# Altium project SEM_BMS_v1.1.PrjPcb
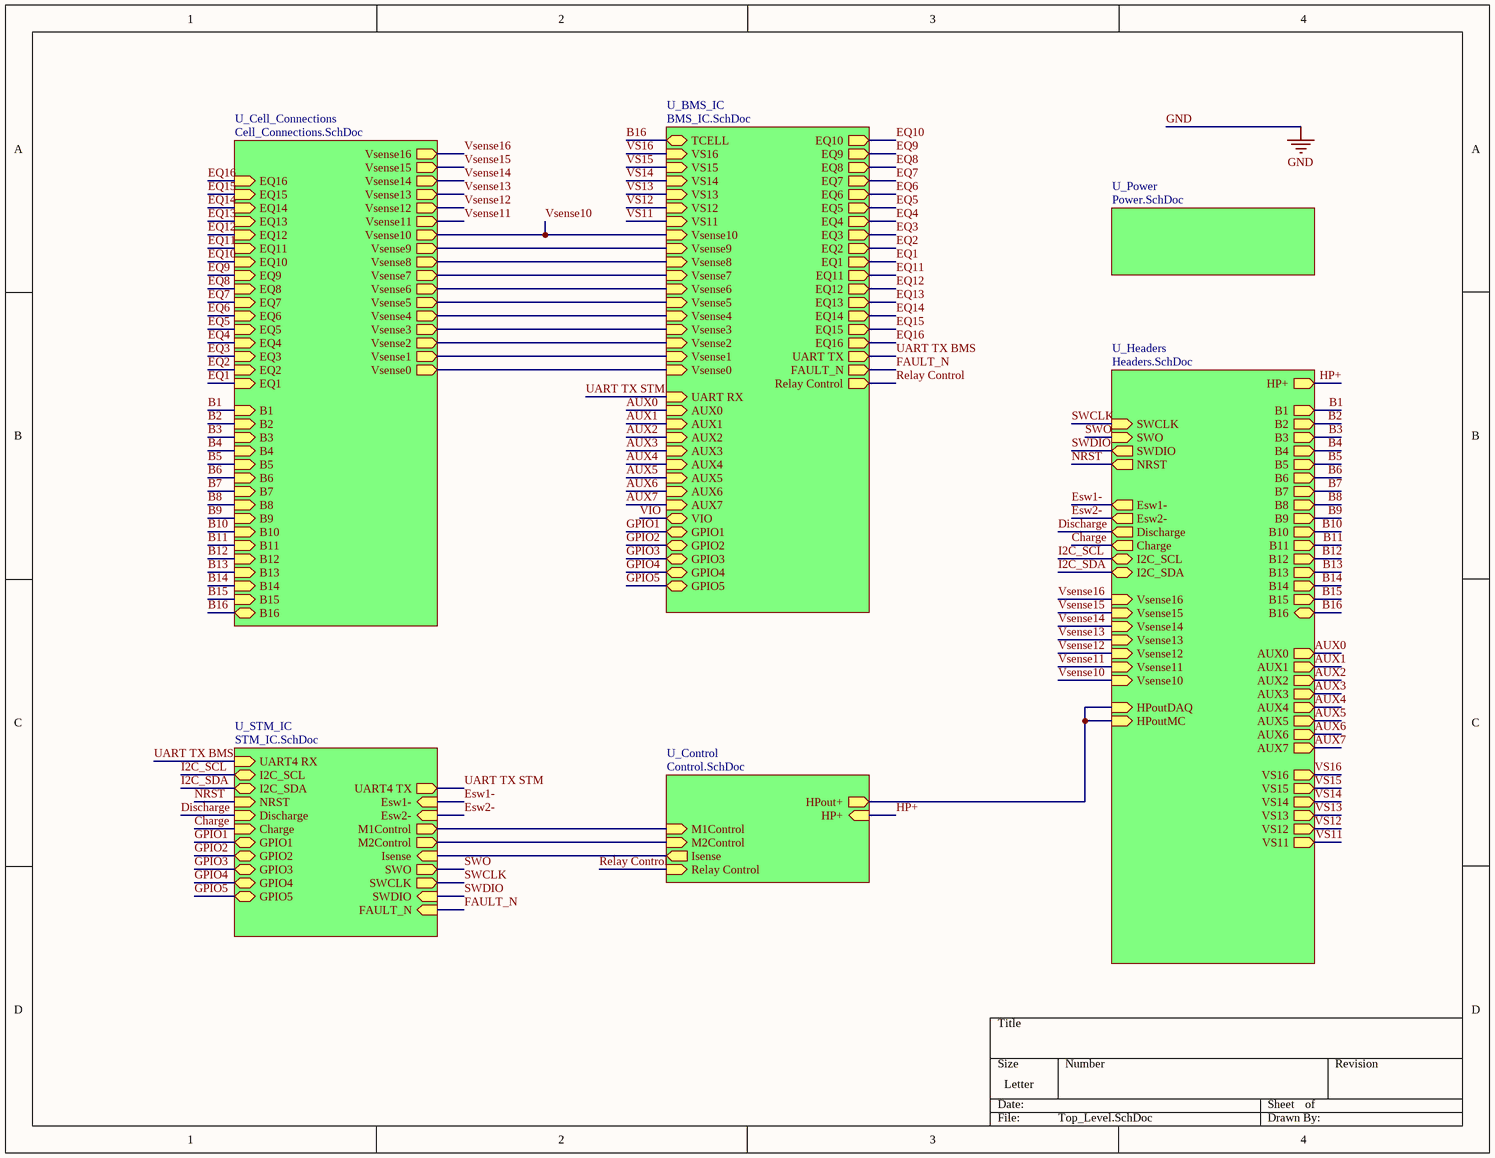
[diagram p0: Top_Level.SchDoc]
7 sheets, 237 parts. Net scope: hierarchical (ports join the sheet entries above them; power ports are global).
Board files: SEM_BMSv1.2.PcbDoc, SEM_BMSv1.3.PcbDoc
Sheets:
  Top_Level.SchDoc
    U_BMS_IC = BMS_IC.SchDoc
    U_Cell_Connections = Cell_Connections.SchDoc
    U_STM_IC = STM_IC.SchDoc
    U_Headers = Headers.SchDoc
    U_Control = Control.SchDoc
    U_Power = Power.SchDoc

## Sheet Top_Level.SchDoc
size Letter

### Sub-sheets
U_BMS_IC = BMS_IC.SchDoc: Vsense10 (in), EQ10 (out), EQ9 (out), EQ8 (out), EQ7 (out), EQ6 (out), EQ5 (out), EQ4 (out), EQ3 (out), EQ2 (out), EQ1 (out), Vsense9 (in), Vsense8 (in), Vsense7 (in), Vsense6 (in), Vsense5 (in), Vsense4 (in), Vsense3 (in), Vsense2 (in), Vsense1 (in), Vsense0 (in), EQ11 (out), EQ12 (out), EQ13 (out), EQ14 (out), EQ15 (out), EQ16 (out), UART TX (out), UART RX (in), FAULT_N (out), AUX0 (in), AUX1 (in), AUX2 (in), AUX3 (in), AUX4 (in), AUX5 (in), AUX6 (in), AUX7 (in), VIO (bidir), GPIO1 (bidir), GPIO2 (bidir), GPIO3 (bidir), GPIO4 (bidir), GPIO5 (bidir), Relay Control (out), TCELL (bidir), VS11 (in), VS12 (in), VS15 (in), VS16 (in), VS13 (in), VS14 (in)
U_Cell_Connections = Cell_Connections.SchDoc: Vsense16 (out), Vsense15 (out), Vsense14 (out), EQ16 (in), EQ15 (in), EQ14 (in), Vsense13 (out), EQ13 (in), EQ12 (in), EQ11 (in), EQ10 (in), Vsense9 (out), Vsense10 (out), Vsense11 (out), Vsense12 (out), EQ9 (in), Vsense8 (out), EQ8 (in), Vsense7 (out), EQ7 (in), Vsense6 (out), EQ6 (in), Vsense5 (out), EQ5 (in), Vsense4 (out), EQ4 (in), Vsense3 (out), EQ3 (in), Vsense2 (out), EQ2 (in), Vsense1 (out), EQ1 (in), Vsense0 (out), B1 (in), B2 (in), B3 (in), B4 (in), B5 (in), B6 (in), B7 (in), B8 (in), B9 (in), B10 (in), B11 (in), B12 (in), B13 (in), B14 (in), B15 (in), B16 (bidir)
U_Control = Control.SchDoc: Isense (out), M2Control (in), M1Control (in), HP+ (in), HPout+ (out), Relay Control (in)
U_Headers = Headers.SchDoc: HP+ (out), B1 (out), B2 (out), B3 (out), B4 (out), B5 (out), B6 (out), B7 (out), B8 (out), B9 (out), B10 (out), B11 (out), B12 (out), B13 (out), B14 (out), B15 (out), B16 (bidir), SWDIO (out), SWCLK (in), SWO (in), NRST (out), AUX0 (out), AUX1 (out), AUX2 (out), AUX3 (out), AUX4 (out), AUX5 (out), AUX6 (out), AUX7 (out), Esw1- (out), Esw2- (out), Discharge (out), Charge (out), I2C_SCL (bidir), I2C_SDA (bidir), VS11 (out), VS16 (out), Vsense11 (in), Vsense16 (in), Vsense10 (in), Vsense14 (in), Vsense13 (in), VS13 (out), Vsense12 (in), VS14 (out), VS12 (out), Vsense15 (in), VS15 (out), HPoutDAQ (in), HPoutMC (in)
U_Power = Power.SchDoc: no entries
U_STM_IC = STM_IC.SchDoc: UART4 TX (out), UART4 RX (in), I2C_SCL (bidir), I2C_SDA (bidir), NRST (in), Esw1- (in), Esw2- (in), SWO (out), SWDIO (in), SWCLK (out), Discharge (in), Charge (in), GPIO1 (bidir), GPIO2 (bidir), GPIO3 (bidir), GPIO4 (bidir), GPIO5 (bidir), Isense (in), M1Control (out), M2Control (out), FAULT_N (in)

### Nets
AUX0: sheet U_BMS_IC/AUX0, sheet U_Headers/AUX0
AUX1: sheet U_BMS_IC/AUX1, sheet U_Headers/AUX1
AUX2: sheet U_BMS_IC/AUX2, sheet U_Headers/AUX2
AUX3: sheet U_BMS_IC/AUX3, sheet U_Headers/AUX3
AUX4: sheet U_BMS_IC/AUX4, sheet U_Headers/AUX4
AUX5: sheet U_BMS_IC/AUX5, sheet U_Headers/AUX5
AUX6: sheet U_BMS_IC/AUX6, sheet U_Headers/AUX6
AUX7: sheet U_BMS_IC/AUX7, sheet U_Headers/AUX7
B1: sheet U_Cell_Connections/B1, sheet U_Headers/B1
B2: sheet U_Cell_Connections/B2, sheet U_Headers/B2
B3: sheet U_Cell_Connections/B3, sheet U_Headers/B3
B4: sheet U_Cell_Connections/B4, sheet U_Headers/B4
B5: sheet U_Cell_Connections/B5, sheet U_Headers/B5
B6: sheet U_Cell_Connections/B6, sheet U_Headers/B6
B7: sheet U_Cell_Connections/B7, sheet U_Headers/B7
B8: sheet U_Cell_Connections/B8, sheet U_Headers/B8
B9: sheet U_Cell_Connections/B9, sheet U_Headers/B9
B10: sheet U_Cell_Connections/B10, sheet U_Headers/B10
B11: sheet U_Cell_Connections/B11, sheet U_Headers/B11
B12: sheet U_Cell_Connections/B12, sheet U_Headers/B12
B13: sheet U_Cell_Connections/B13, sheet U_Headers/B13
B14: sheet U_Cell_Connections/B14, sheet U_Headers/B14
B15: sheet U_Cell_Connections/B15, sheet U_Headers/B15
B16: sheet U_BMS_IC/TCELL, sheet U_Cell_Connections/B16, sheet U_Headers/B16
Charge: sheet U_STM_IC/Charge, sheet U_Headers/Charge
Discharge: sheet U_STM_IC/Discharge, sheet U_Headers/Discharge
EQ1: sheet U_BMS_IC/EQ1, sheet U_Cell_Connections/EQ1
EQ2: sheet U_BMS_IC/EQ2, sheet U_Cell_Connections/EQ2
EQ3: sheet U_BMS_IC/EQ3, sheet U_Cell_Connections/EQ3
EQ4: sheet U_BMS_IC/EQ4, sheet U_Cell_Connections/EQ4
EQ5: sheet U_BMS_IC/EQ5, sheet U_Cell_Connections/EQ5
EQ6: sheet U_BMS_IC/EQ6, sheet U_Cell_Connections/EQ6
EQ7: sheet U_BMS_IC/EQ7, sheet U_Cell_Connections/EQ7
EQ8: sheet U_BMS_IC/EQ8, sheet U_Cell_Connections/EQ8
EQ9: sheet U_BMS_IC/EQ9, sheet U_Cell_Connections/EQ9
EQ10: sheet U_BMS_IC/EQ10, sheet U_Cell_Connections/EQ10
EQ11: sheet U_BMS_IC/EQ11, sheet U_Cell_Connections/EQ11
EQ12: sheet U_BMS_IC/EQ12, sheet U_Cell_Connections/EQ12
EQ13: sheet U_BMS_IC/EQ13, sheet U_Cell_Connections/EQ13
EQ14: sheet U_BMS_IC/EQ14, sheet U_Cell_Connections/EQ14
EQ15: sheet U_BMS_IC/EQ15, sheet U_Cell_Connections/EQ15
EQ16: sheet U_BMS_IC/EQ16, sheet U_Cell_Connections/EQ16
Esw1-: sheet U_STM_IC/Esw1-, sheet U_Headers/Esw1-  [project net Esw1]
Esw2-: sheet U_STM_IC/Esw2-, sheet U_Headers/Esw2-  [project net Esw2]
FAULT_N: sheet U_BMS_IC/FAULT_N, sheet U_STM_IC/FAULT_N
GPIO1: sheet U_BMS_IC/GPIO1, sheet U_STM_IC/GPIO1
GPIO2: sheet U_BMS_IC/GPIO2, sheet U_STM_IC/GPIO2
GPIO3: sheet U_BMS_IC/GPIO3, sheet U_STM_IC/GPIO3
GPIO4: sheet U_BMS_IC/GPIO4, sheet U_STM_IC/GPIO4
GPIO5: sheet U_BMS_IC/GPIO5, sheet U_STM_IC/GPIO5
HP+: sheet U_Headers/HP+, sheet U_Control/HP+
I2C_SCL: sheet U_STM_IC/I2C_SCL, sheet U_Headers/I2C_SCL
I2C_SDA: sheet U_STM_IC/I2C_SDA, sheet U_Headers/I2C_SDA
NRST: sheet U_STM_IC/NRST, sheet U_Headers/NRST
Relay Control: sheet U_BMS_IC/Relay Control, sheet U_Control/Relay Control
SWCLK: sheet U_STM_IC/SWCLK, sheet U_Headers/SWCLK
SWDIO: sheet U_STM_IC/SWDIO, sheet U_Headers/SWDIO
SWO: sheet U_STM_IC/SWO, sheet U_Headers/SWO
UART TX BMS: sheet U_BMS_IC/UART TX, sheet U_STM_IC/UART4 RX
UART TX STM: sheet U_BMS_IC/UART RX, sheet U_STM_IC/UART4 TX
VS11: sheet U_BMS_IC/VS11, sheet U_Headers/VS11
VS12: sheet U_BMS_IC/VS12, sheet U_Headers/VS12
VS13: sheet U_BMS_IC/VS13, sheet U_Headers/VS13
VS14: sheet U_BMS_IC/VS14, sheet U_Headers/VS14
VS15: sheet U_BMS_IC/VS15, sheet U_Headers/VS15
VS16: sheet U_BMS_IC/VS16, sheet U_Headers/VS16
Vsense10: sheet U_BMS_IC/Vsense10, sheet U_Cell_Connections/Vsense10, sheet U_Headers/Vsense10
Vsense11: sheet U_Cell_Connections/Vsense11, sheet U_Headers/Vsense11
Vsense12: sheet U_Cell_Connections/Vsense12, sheet U_Headers/Vsense12
Vsense13: sheet U_Cell_Connections/Vsense13, sheet U_Headers/Vsense13
Vsense14: sheet U_Cell_Connections/Vsense14, sheet U_Headers/Vsense14
Vsense15: sheet U_Cell_Connections/Vsense15, sheet U_Headers/Vsense15
Vsense16: sheet U_Cell_Connections/Vsense16, sheet U_Headers/Vsense16
NetC1_1: sheet U_BMS_IC/Vsense1, sheet U_Cell_Connections/Vsense1
NetC2_1: sheet U_BMS_IC/Vsense2, sheet U_Cell_Connections/Vsense2
NetC3_1: sheet U_BMS_IC/Vsense3, sheet U_Cell_Connections/Vsense3
NetC4_1: sheet U_BMS_IC/Vsense4, sheet U_Cell_Connections/Vsense4
NetC5_1: sheet U_BMS_IC/Vsense5, sheet U_Cell_Connections/Vsense5
NetC6_1: sheet U_BMS_IC/Vsense6, sheet U_Cell_Connections/Vsense6
NetC7_1: sheet U_BMS_IC/Vsense7, sheet U_Cell_Connections/Vsense7
NetC8_1: sheet U_BMS_IC/Vsense8, sheet U_Cell_Connections/Vsense8
NetC9_1: sheet U_BMS_IC/Vsense9, sheet U_Cell_Connections/Vsense9
NetC18_2: sheet U_BMS_IC/Vsense0, sheet U_Cell_Connections/Vsense0
NetP2_1: sheet U_Headers/HPoutDAQ, sheet U_Headers/HPoutMC, sheet U_Control/HPout+
NetU2_20: sheet U_STM_IC/Isense, sheet U_Control/Isense
NetU2_53: sheet U_STM_IC/M1Control, sheet U_Control/M1Control
(unnamed): sheet U_STM_IC/M2Control, sheet U_Control/M2Control

## Sheet BMS_IC.SchDoc
size Letter
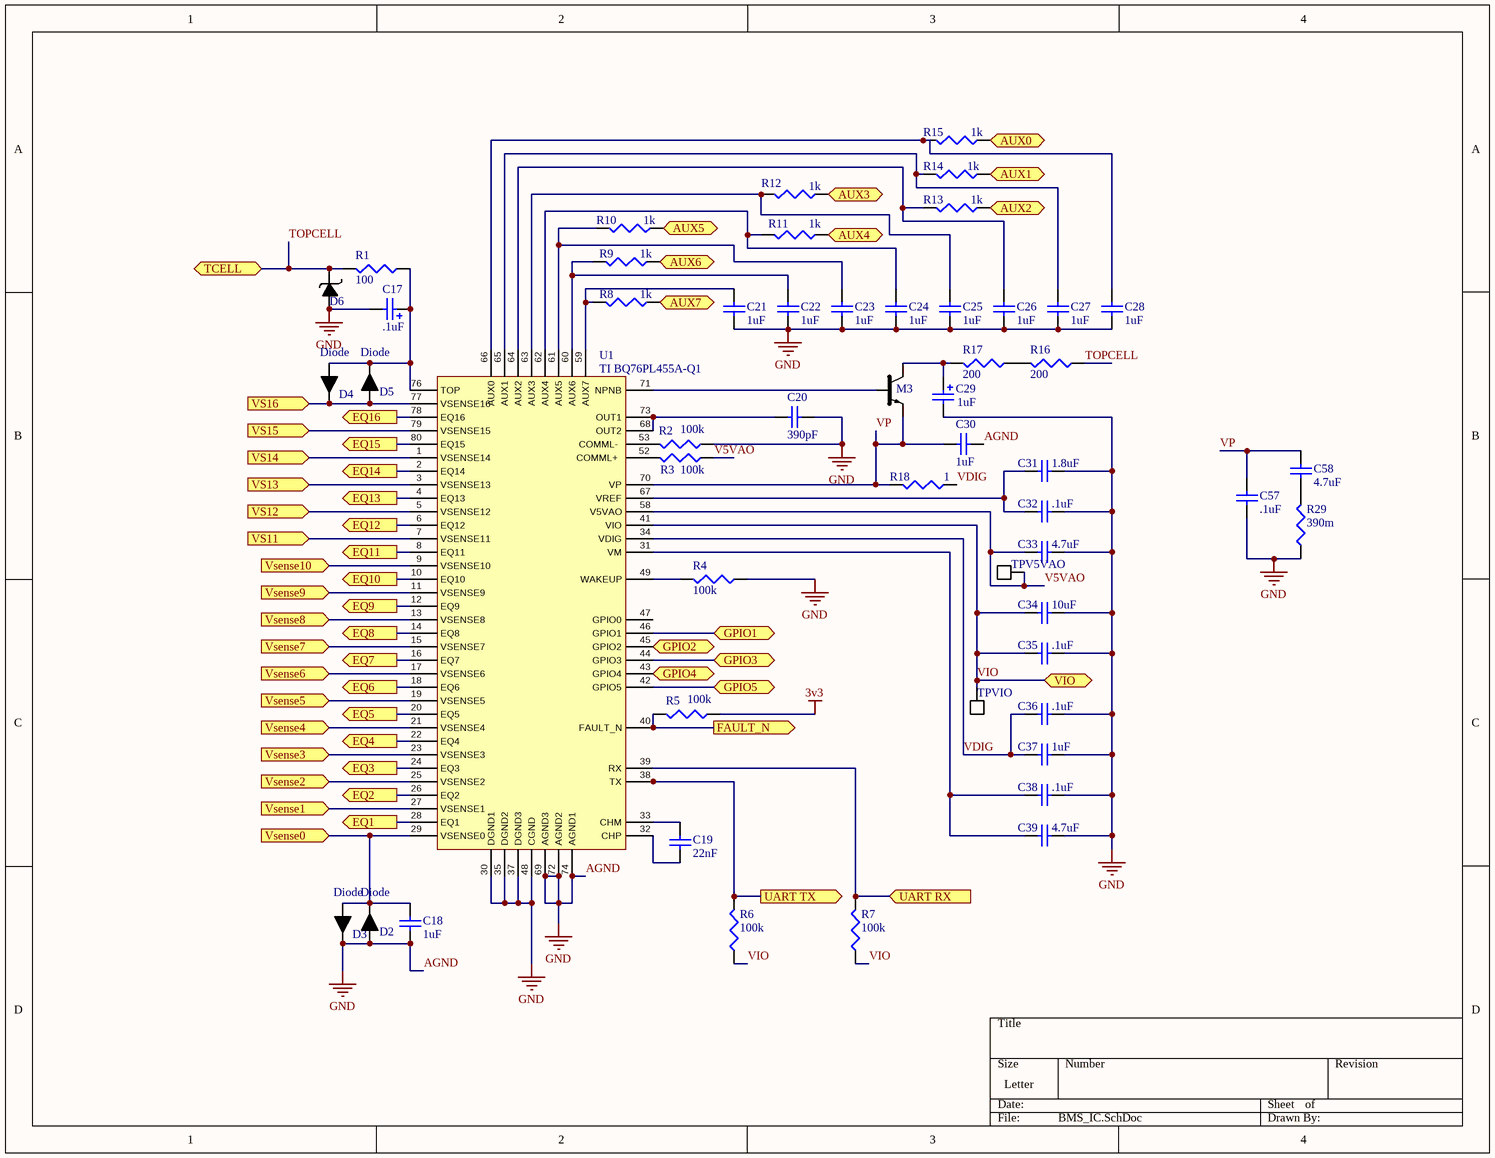
[diagram p1: BMS_IC.SchDoc]

### Parts
C17  value .1uF  [SMD1206 Polarized]  (hidden comment: Cap)
C18  value 1uF  [SMD0603]  (hidden comment: Cap)
C19  value 22nF  [SMD0603]  (hidden comment: Cap)
C20  value 390pF  [SMD0805]  (hidden comment: Cap)
C21  value 1uF  [SMD0603]  (hidden comment: Cap)
C22  value 1uF  [SMD0603]  (hidden comment: Cap)
C23  value 1uF  [SMD0603]  (hidden comment: Cap)
C24  value 1uF  [SMD0603]  (hidden comment: Cap)
C25  value 1uF  [SMD0603]  (hidden comment: Cap)
C26  value 1uF  [SMD0603]  (hidden comment: Cap)
C27  value 1uF  [SMD0603]  (hidden comment: Cap)
C28  value 1uF  [SMD0603]  (hidden comment: Cap)
C29  value 1uF  [SMD1206 Polarized]  (hidden comment: Cap)
C30  value 1uF  [SMD0603]  (hidden comment: Cap)
C31  value 1.8uF  [SMD0603]  (hidden comment: Cap)
C32  value .1uF  [SMD0603]  (hidden comment: Cap)
C33  value 4.7uF  [SMD0603]  (hidden comment: Cap)
C34  value 10uF  [SMD0603]  (hidden comment: Cap)
C35  value .1uF  [SMD0603]  (hidden comment: Cap)
C36  value .1uF  [SMD0603]  (hidden comment: Cap)
C37  value 1uF  [SMD0603]  (hidden comment: Cap)
C38  value .1uF  [SMD0603]  (hidden comment: Cap)
C39  value 4.7uF  [SMD0603]  (hidden comment: Cap)
C57  value .1uF  [SMD0603]  (hidden comment: Cap)
C58  value 4.7uF  [SMD0603]  (hidden comment: Cap)
D2  Diode  [DPAK23]
D3  Diode  [DPAK23]
D4  Diode  [DPAK23]
D5  Diode  [DPAK23]
D6  Zener Diode  [TVS Diode]  (value not drawn)
M3  BJT  [SOT23]  (value not drawn)
R1  value 100  [SMD0603]  (hidden comment: Res)
R2  value 100k  [SMD0603]  (hidden comment: Res)
R3  value 100k  [SMD0603]  (hidden comment: Res)
R4  value 100k  [SMD0603]  (hidden comment: Res)
R5  value 100k  [SMD0603]  (hidden comment: Res)
R6  value 100k  [SMD0603]  (hidden comment: Res)
R7  value 100k  [SMD0603]  (hidden comment: Res)
R8  value 1k  [SMD0603]  (hidden comment: Res)
R9  value 1k  [SMD0603]  (hidden comment: Res)
R10  value 1k  [SMD0603]  (hidden comment: Res)
R11  value 1k  [SMD0603]  (hidden comment: Res)
R12  value 1k  [SMD0603]  (hidden comment: Res)
R13  value 1k  [SMD0603]  (hidden comment: Res)
R14  value 1k  [SMD0603]  (hidden comment: Res)
R15  value 1k  [SMD0603]  (hidden comment: Res)
R16  value 200  [SMD0603]  (hidden comment: Res)
R17  value 200  [SMD0603]  (hidden comment: Res)
R18  value 1  [SMD0603]  (hidden comment: Res)
R29  value 390m  [SMD0603]  (hidden comment: Res)
TPV5VAO  Test Point  [Test Point]  (value not drawn)
TPVIO  Test Point  [Test Point]  (value not drawn)
U1  TI BQ76PL455A-Q1  [TQFP-80]

### Ports
AUX0 (in), AUX1 (in), AUX2 (in), AUX3 (in), AUX4 (in), AUX5 (in), AUX6 (in), AUX7 (in), EQ1 (out), EQ2 (out), EQ3 (out), EQ4 (out), EQ5 (out), EQ6 (out), EQ7 (out), EQ8 (out), EQ9 (out), EQ10 (out), EQ11 (out), EQ12 (out), EQ13 (out), EQ14 (out), EQ15 (out), EQ16 (out), FAULT_N (out), GPIO1 (bidir), GPIO2 (bidir), GPIO3 (bidir), GPIO4 (bidir), GPIO5 (bidir), TCELL (bidir), UART RX (in), UART TX (out), VIO (bidir), VS11 (in), VS12 (in), VS13 (in), VS14 (in), VS15 (in), VS16 (in), Vsense0 (in), Vsense1 (in), Vsense2 (in), Vsense3 (in), Vsense4 (in), Vsense5 (in), Vsense6 (in), Vsense7 (in), Vsense8 (in), Vsense9 (in), Vsense10 (in)

### Nets
3v3: R5.1
AGND: C17.2 C18.1 C20.1 C21.1 C22.1 C23.1 C24.1 C25.1 C26.1 C27.1 C28.1 C29.2 C30.1 C31.1 C32.1 C33.1 C34.1 C35.1 C36.1 C37.1 C38.1 C39.1 C57.1 D2.3(Anode_(+)) D3.2(Cathode_(-)) D6.1 R2.1 R4.1 R29.1 U1.30(DGND1) U1.35(DGND2) U1.37(DGND3) U1.48(CGND) U1.69(AGND3) U1.72(AGND2) U1.74(AGND1)  [also labelled GND]
AUX0: R15.1 ; port AUX0
AUX1: R14.1 ; port AUX1
AUX2: R13.1 ; port AUX2
AUX3: R12.1 ; port AUX3
AUX4: R11.1 ; port AUX4
AUX5: R10.1 ; port AUX5
AUX6: R9.1 ; port AUX6
AUX7: R8.1 ; port AUX7
EQ1: U1.28(EQ1) ; port EQ1
EQ2: U1.26(EQ2) ; port EQ2
EQ3: U1.24(EQ3) ; port EQ3
EQ4: U1.22(EQ4) ; port EQ4
EQ5: U1.20(EQ5) ; port EQ5
EQ6: U1.18(EQ6) ; port EQ6
EQ7: U1.16(EQ7) ; port EQ7
EQ8: U1.14(EQ8) ; port EQ8
EQ9: U1.12(EQ9) ; port EQ9
EQ10: U1.10(EQ10) ; port EQ10
EQ11: U1.8(EQ11) ; port EQ11
EQ12: U1.6(EQ12) ; port EQ12
EQ13: U1.4(EQ13) ; port EQ13
EQ14: U1.2(EQ14) ; port EQ14
EQ15: U1.80(EQ15) ; port EQ15
EQ16: U1.78(EQ16) ; port EQ16
FAULT_N: R5.2 U1.40(FAULT_N) ; port FAULT_N
GPIO1: U1.46(GPIO1) ; port GPIO1
GPIO2: U1.45(GPIO2) ; port GPIO2
GPIO3: U1.44(GPIO3) ; port GPIO3
GPIO4: U1.43(GPIO4) ; port GPIO4
GPIO5: U1.42(GPIO5) ; port GPIO5
TOPCELL: D6.2 R1.2 R16.1 ; port TCELL  [project net B16]
UART TX BMS: R6.2 U1.38(TX) ; port UART TX
UART TX STM: R7.2 U1.39(RX) ; port UART RX
V5VAO: C33.2 R3.1 TPV5VAO.1 U1.58(V5VAO)
VDIG: C36.2 C37.2 R18.1 U1.34(VDIG)
VIO: C34.2 C35.2 R6.1 R7.1 TPVIO.1 U1.41(VIO) ; port VIO
VP: C30.2 C57.2 C58.2 M3.3 R18.2 U1.70(VP)
VS11: U1.7(VSENSE11) ; port VS11
VS12: U1.5(VSENSE12) ; port VS12
VS13: U1.3(VSENSE13) ; port VS13
VS14: U1.1(VSENSE14) ; port VS14
VS15: U1.79(VSENSE15) ; port VS15
VS16: D4.2(Cathode_(-)) D5.3(Anode_(+)) U1.77(VSENSE16) ; port VS16
Vsense10: U1.9(VSENSE10) ; port Vsense10
NetC1_1: U1.27(VSENSE1) ; port Vsense1
NetC2_1: U1.25(VSENSE2) ; port Vsense2
NetC3_1: U1.23(VSENSE3) ; port Vsense3
NetC4_1: U1.21(VSENSE4) ; port Vsense4
NetC5_1: U1.19(VSENSE5) ; port Vsense5
NetC6_1: U1.17(VSENSE6) ; port Vsense6
NetC7_1: U1.15(VSENSE7) ; port Vsense7
NetC8_1: U1.13(VSENSE8) ; port Vsense8
NetC9_1: U1.11(VSENSE9) ; port Vsense9
NetC17_1: C17.1 D4.3(Anode_(+)) D5.2(Cathode_(-)) R1.1 U1.76(TOP)
NetC18_2: C18.2 D2.2(Cathode_(-)) D3.3(Anode_(+)) U1.29(VSENSE0) ; port Vsense0
NetC19_1: C19.1 U1.32(CHP)
NetC19_2: C19.2 U1.33(CHM)
NetC20_2: C20.2 U1.68(OUT2) U1.73(OUT1)
NetC21_2: C21.2 R8.2 U1.59(AUX7)
NetC22_2: C22.2 R9.2 U1.60(AUX6)
NetC23_2: C23.2 R10.2 U1.61(AUX5)
NetC24_2: C24.2 R11.2 U1.62(AUX4)
NetC25_2: C25.2 R12.2 U1.63(AUX3)
NetC26_2: C26.2 R13.2 U1.64(AUX2)
NetC27_2: C27.2 R14.2 U1.65(AUX1)
NetC28_2: C28.2 R15.2 U1.66(AUX0)
NetC29_1: C29.1 M3.1 R17.2
NetC31_2: C31.2 C32.2 U1.67(VREF)
NetC38_2: C38.2 C39.2 U1.31(VM)
NetC58_1: C58.1 R29.2
NetM3_2: M3.2 U1.71(NPNB)
NetR2_2: R2.2 U1.53(COMML-)
NetR3_2: R3.2 U1.52(COMML+)
NetR4_2: R4.2 U1.49(WAKEUP)
NetR16_2: R16.2 R17.1

Not connected (* = marked no-connect by the designer): U1 47(GPIO0)

### Library data of the parts
C17 C29 = Capacitor Polarized: Polarized Capacitor (Surface Mount)
C18-C28 C30-C39 C57 C58 = Capacitor Ceramic: Ceramic Chip Capacitor
R1-R18 R29 = Resistor
TPV5VAO TPVIO = Test Point: Supplier 1: Digi-Key; Supplier Part Number 1: 5019KCT-ND

## Sheet Cell_Connections.SchDoc
size Letter
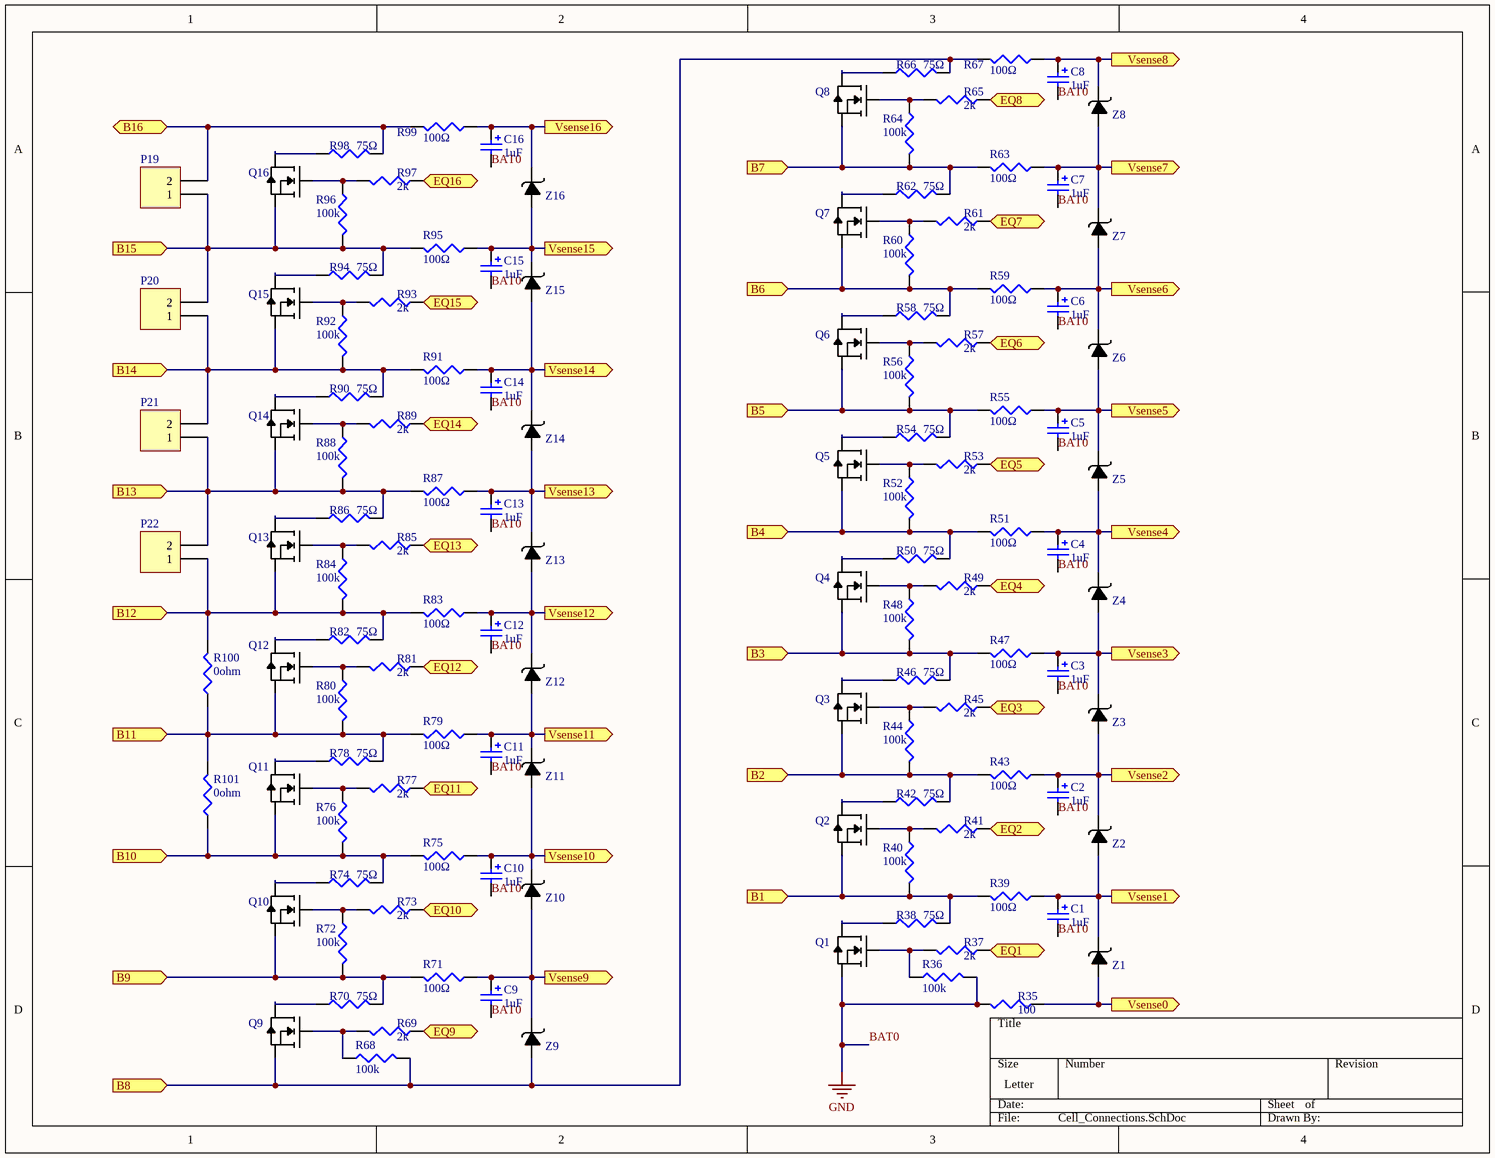
[diagram p2: Cell_Connections.SchDoc]

### Parts
C1  value 1uF  [SMD1206 Polarized]  (hidden comment: Cap)
C2  value 1uF  [SMD1206 Polarized]  (hidden comment: Cap)
C3  value 1uF  [SMD1206 Polarized]  (hidden comment: Cap)
C4  value 1uF  [SMD1206 Polarized]  (hidden comment: Cap)
C5  value 1uF  [SMD1206 Polarized]  (hidden comment: Cap)
C6  value 1uF  [SMD1206 Polarized]  (hidden comment: Cap)
C7  value 1uF  [SMD1206 Polarized]  (hidden comment: Cap)
C8  value 1uF  [SMD1206 Polarized]  (hidden comment: Cap)
C9  value 1uF  [SMD1206 Polarized]  (hidden comment: Cap)
C10  value 1uF  [SMD1206 Polarized]  (hidden comment: Cap)
C11  value 1uF  [SMD1206 Polarized]  (hidden comment: Cap)
C12  value 1uF  [SMD1206 Polarized]  (hidden comment: Cap)
C13  value 1uF  [SMD1206 Polarized]  (hidden comment: Cap)
C14  value 1uF  [SMD1206 Polarized]  (hidden comment: Cap)
C15  value 1uF  [SMD1206 Polarized]  (hidden comment: Cap)
C16  value 1uF  [SMD1206 Polarized]  (hidden comment: Cap)
P19  Header  [Header 2x1]  (value not drawn)
P20  Header  [Header 2x1]  (value not drawn)
P21  Header  [Header 2x1]  (value not drawn)
P22  Header  [Header 2x1]  (value not drawn)
Q1  Transistor  [Transistor 3-Lead]  (value not drawn)
Q2  Transistor  [Transistor 3-Lead]  (value not drawn)
Q3  Transistor  [Transistor 3-Lead]  (value not drawn)
Q4  Transistor  [Transistor 3-Lead]  (value not drawn)
Q5  Transistor  [Transistor 3-Lead]  (value not drawn)
Q6  Transistor  [Transistor 3-Lead]  (value not drawn)
Q7  Transistor  [Transistor 3-Lead]  (value not drawn)
Q8  Transistor  [Transistor 3-Lead]  (value not drawn)
Q9  Transistor  [Transistor 3-Lead]  (value not drawn)
Q10  Transistor  [Transistor 3-Lead]  (value not drawn)
Q11  Transistor  [Transistor 3-Lead]  (value not drawn)
Q12  Transistor  [Transistor 3-Lead]  (value not drawn)
Q13  Transistor  [Transistor 3-Lead]  (value not drawn)
Q14  Transistor  [Transistor 3-Lead]  (value not drawn)
Q15  Transistor  [Transistor 3-Lead]  (value not drawn)
Q16  Transistor  [Transistor 3-Lead]  (value not drawn)
R35  value 100  [SMD0603]  (hidden comment: Res)
R36  value 100k  [SMD0603]  (hidden comment: Res)
R37  value 2k  [SMD0603]  (hidden comment: Res)
R38  value 75Ω  [SMD0603]  (hidden comment: Res)
R39  value 100Ω  [SMD0603]  (hidden comment: Res)
R40  value 100k  [SMD0603]  (hidden comment: Res)
R41  value 2k  [SMD0603]  (hidden comment: Res)
R42  value 75Ω  [SMD0603]  (hidden comment: Res)
R43  value 100Ω  [SMD0603]  (hidden comment: Res)
R44  value 100k  [SMD0603]  (hidden comment: Res)
R45  value 2k  [SMD0603]  (hidden comment: Res)
R46  value 75Ω  [SMD0603]  (hidden comment: Res)
R47  value 100Ω  [SMD0603]  (hidden comment: Res)
R48  value 100k  [SMD0603]  (hidden comment: Res)
R49  value 2k  [SMD0603]  (hidden comment: Res)
R50  value 75Ω  [SMD0603]  (hidden comment: Res)
R51  value 100Ω  [SMD0603]  (hidden comment: Res)
R52  value 100k  [SMD0603]  (hidden comment: Res)
R53  value 2k  [SMD0603]  (hidden comment: Res)
R54  value 75Ω  [SMD0603]  (hidden comment: Res)
R55  value 100Ω  [SMD0603]  (hidden comment: Res)
R56  value 100k  [SMD0603]  (hidden comment: Res)
R57  value 2k  [SMD0603]  (hidden comment: Res)
R58  value 75Ω  [SMD0603]  (hidden comment: Res)
R59  value 100Ω  [SMD0603]  (hidden comment: Res)
R60  value 100k  [SMD0603]  (hidden comment: Res)
R61  value 2k  [SMD0603]  (hidden comment: Res)
R62  value 75Ω  [SMD0603]  (hidden comment: Res)
R63  value 100Ω  [SMD0603]  (hidden comment: Res)
R64  value 100k  [SMD0603]  (hidden comment: Res)
R65  value 2k  [SMD0603]  (hidden comment: Res)
R66  value 75Ω  [SMD0603]  (hidden comment: Res)
R67  value 100Ω  [SMD0603]  (hidden comment: Res)
R68  value 100k  [SMD0603]  (hidden comment: Res)
R69  value 2k  [SMD0603]  (hidden comment: Res)
R70  value 75Ω  [SMD0603]  (hidden comment: Res)
R71  value 100Ω  [SMD0603]  (hidden comment: Res)
R72  value 100k  [SMD0603]  (hidden comment: Res)
R73  value 2k  [SMD0603]  (hidden comment: Res)
R74  value 75Ω  [SMD0603]  (hidden comment: Res)
R75  value 100Ω  [SMD0603]  (hidden comment: Res)
R76  value 100k  [SMD0603]  (hidden comment: Res)
R77  value 2k  [SMD0603]  (hidden comment: Res)
R78  value 75Ω  [SMD0603]  (hidden comment: Res)
R79  value 100Ω  [SMD0603]  (hidden comment: Res)
R80  value 100k  [SMD0603]  (hidden comment: Res)
R81  value 2k  [SMD0603]  (hidden comment: Res)
R82  value 75Ω  [SMD0603]  (hidden comment: Res)
R83  value 100Ω  [SMD0603]  (hidden comment: Res)
R84  value 100k  [SMD0603]  (hidden comment: Res)
R85  value 2k  [SMD0603]  (hidden comment: Res)
R86  value 75Ω  [SMD0603]  (hidden comment: Res)
R87  value 100Ω  [SMD0603]  (hidden comment: Res)
R88  value 100k  [SMD0603]  (hidden comment: Res)
R89  value 2k  [SMD0603]  (hidden comment: Res)
R90  value 75Ω  [SMD0603]  (hidden comment: Res)
R91  value 100Ω  [SMD0603]  (hidden comment: Res)
R92  value 100k  [SMD0603]  (hidden comment: Res)
R93  value 2k  [SMD0603]  (hidden comment: Res)
R94  value 75Ω  [SMD0603]  (hidden comment: Res)
R95  value 100Ω  [SMD0603]  (hidden comment: Res)
R96  value 100k  [SMD0603]  (hidden comment: Res)
R97  value 2k  [SMD0603]  (hidden comment: Res)
R98  value 75Ω  [SMD0603]  (hidden comment: Res)
R99  value 100Ω  [SMD0603]  (hidden comment: Res)
R100  value 0ohm  [SMD0603]  (hidden comment: Res)
R101  value 0ohm  [SMD0603]  (hidden comment: Res)
Z1  Zener Diode  [ZenerCell]  (value not drawn)
Z2  Zener Diode  [ZenerCell]  (value not drawn)
Z3  Zener Diode  [ZenerCell]  (value not drawn)
Z4  Zener Diode  [ZenerCell]  (value not drawn)
Z5  Zener Diode  [ZenerCell]  (value not drawn)
Z6  Zener Diode  [ZenerCell]  (value not drawn)
Z7  Zener Diode  [ZenerCell]  (value not drawn)
Z8  Zener Diode  [ZenerCell]  (value not drawn)
Z9  Zener Diode  [ZenerCell]  (value not drawn)
Z10  Zener Diode  [ZenerCell]  (value not drawn)
Z11  Zener Diode  [ZenerCell]  (value not drawn)
Z12  Zener Diode  [ZenerCell]  (value not drawn)
Z13  Zener Diode  [ZenerCell]  (value not drawn)
Z14  Zener Diode  [ZenerCell]  (value not drawn)
Z15  Zener Diode  [ZenerCell]  (value not drawn)
Z16  Zener Diode  [ZenerCell]  (value not drawn)

### Ports
B1 (in), B2 (in), B3 (in), B4 (in), B5 (in), B6 (in), B7 (in), B8 (in), B9 (in), B10 (in), B11 (in), B12 (in), B13 (in), B14 (in), B15 (in), B16 (bidir), EQ1 (in), EQ2 (in), EQ3 (in), EQ4 (in), EQ5 (in), EQ6 (in), EQ7 (in), EQ8 (in), EQ9 (in), EQ10 (in), EQ11 (in), EQ12 (in), EQ13 (in), EQ14 (in), EQ15 (in), EQ16 (in), Vsense0 (out), Vsense1 (out), Vsense2 (out), Vsense3 (out), Vsense4 (out), Vsense5 (out), Vsense6 (out), Vsense7 (out), Vsense8 (out), Vsense9 (out), Vsense10 (out), Vsense11 (out), Vsense12 (out), Vsense13 (out), Vsense14 (out), Vsense15 (out), Vsense16 (out)

### Nets
BAT0: C1.2 C2.2 C3.2 C4.2 C5.2 C6.2 C7.2 C8.2 C9.2 C10.2 C11.2 C12.2 C13.2 C14.2 C15.2 C16.2 Q1.3(S) R35.2 R36.2  [also labelled GND]  [project net AGND]
B1: Q2.3(S) R38.2 R39.2 R40.2 ; port B1
B2: Q3.3(S) R42.2 R43.2 R44.2 ; port B2
B3: Q4.3(S) R46.2 R47.2 R48.2 ; port B3
B4: Q5.3(S) R50.2 R51.2 R52.2 ; port B4
B5: Q6.3(S) R54.2 R55.2 R56.2 ; port B5
B6: Q7.3(S) R58.2 R59.2 R60.2 ; port B6
B7: Q8.3(S) R62.2 R63.2 R64.2 ; port B7
B8: Q9.3(S) R66.2 R67.2 R68.2 Z9.1 ; port B8
B9: Q10.3(S) R70.2 R71.2 R72.2 ; port B9
B10: Q11.3(S) R74.2 R75.2 R76.2 R101.1 ; port B10
B11: Q12.3(S) R78.2 R79.2 R80.2 R100.1 R101.2 ; port B11
B12: P22.1 Q13.3(S) R82.2 R83.2 R84.2 R100.2 ; port B12
B13: P21.1 P22.2 Q14.3(S) R86.2 R87.2 R88.2 ; port B13
B14: P20.1 P21.2 Q15.3(S) R90.2 R91.2 R92.2 ; port B14
B15: P19.1 P20.2 Q16.3(S) R94.2 R95.2 R96.2 ; port B15
B16: P19.2 R98.2 R99.2 ; port B16
EQ1: R37.1 ; port EQ1
EQ2: R41.1 ; port EQ2
EQ3: R45.1 ; port EQ3
EQ4: R49.1 ; port EQ4
EQ5: R53.1 ; port EQ5
EQ6: R57.1 ; port EQ6
EQ7: R61.1 ; port EQ7
EQ8: R65.1 ; port EQ8
EQ9: R69.1 ; port EQ9
EQ10: R73.1 ; port EQ10
EQ11: R77.1 ; port EQ11
EQ12: R81.1 ; port EQ12
EQ13: R85.1 ; port EQ13
EQ14: R89.1 ; port EQ14
EQ15: R93.1 ; port EQ15
EQ16: R97.1 ; port EQ16
Vsense10: C10.1 R75.1 Z10.2 Z11.1 ; port Vsense10
Vsense11: C11.1 R79.1 Z11.2 Z12.1 ; port Vsense11
Vsense12: C12.1 R83.1 Z12.2 Z13.1 ; port Vsense12
Vsense13: C13.1 R87.1 Z13.2 Z14.1 ; port Vsense13
Vsense14: C14.1 R91.1 Z14.2 Z15.1 ; port Vsense14
Vsense15: C15.1 R95.1 Z15.2 Z16.1 ; port Vsense15
Vsense16: C16.1 R99.1 Z16.2 ; port Vsense16
NetC1_1: C1.1 R39.1 Z1.2 Z2.1 ; port Vsense1
NetC2_1: C2.1 R43.1 Z2.2 Z3.1 ; port Vsense2
NetC3_1: C3.1 R47.1 Z3.2 Z4.1 ; port Vsense3
NetC4_1: C4.1 R51.1 Z4.2 Z5.1 ; port Vsense4
NetC5_1: C5.1 R55.1 Z5.2 Z6.1 ; port Vsense5
NetC6_1: C6.1 R59.1 Z6.2 Z7.1 ; port Vsense6
NetC7_1: C7.1 R63.1 Z7.2 Z8.1 ; port Vsense7
NetC8_1: C8.1 R67.1 Z8.2 ; port Vsense8
NetC9_1: C9.1 R71.1 Z9.2 Z10.1 ; port Vsense9
NetC18_2: R35.1 Z1.1 ; port Vsense0
NetQ1_1: Q1.1(D) R38.1
NetQ1_2: Q1.2(G) R36.1 R37.2
NetQ2_1: Q2.1(D) R42.1
NetQ2_2: Q2.2(G) R40.1 R41.2
NetQ3_1: Q3.1(D) R46.1
NetQ3_2: Q3.2(G) R44.1 R45.2
NetQ4_1: Q4.1(D) R50.1
NetQ4_2: Q4.2(G) R48.1 R49.2
NetQ5_1: Q5.1(D) R54.1
NetQ5_2: Q5.2(G) R52.1 R53.2
NetQ6_1: Q6.1(D) R58.1
NetQ6_2: Q6.2(G) R56.1 R57.2
NetQ7_1: Q7.1(D) R62.1
NetQ7_2: Q7.2(G) R60.1 R61.2
NetQ8_1: Q8.1(D) R66.1
NetQ8_2: Q8.2(G) R64.1 R65.2
NetQ9_1: Q9.1(D) R70.1
NetQ9_2: Q9.2(G) R68.1 R69.2
NetQ10_1: Q10.1(D) R74.1
NetQ10_2: Q10.2(G) R72.1 R73.2
NetQ11_1: Q11.1(D) R78.1
NetQ11_2: Q11.2(G) R76.1 R77.2
NetQ12_1: Q12.1(D) R82.1
NetQ12_2: Q12.2(G) R80.1 R81.2
NetQ13_1: Q13.1(D) R86.1
NetQ13_2: Q13.2(G) R84.1 R85.2
NetQ14_1: Q14.1(D) R90.1
NetQ14_2: Q14.2(G) R88.1 R89.2
NetQ15_1: Q15.1(D) R94.1
NetQ15_2: Q15.2(G) R92.1 R93.2
NetQ16_1: Q16.1(D) R98.1
NetQ16_2: Q16.2(G) R96.1 R97.2

### Library data of the parts
C1-C16 = Capacitor Polarized: Polarized Capacitor (Surface Mount)
P19-P22 = Header 2x1: Header, 2-Pin
R35-R101 = Resistor

## Sheet STM_IC.SchDoc
size Letter
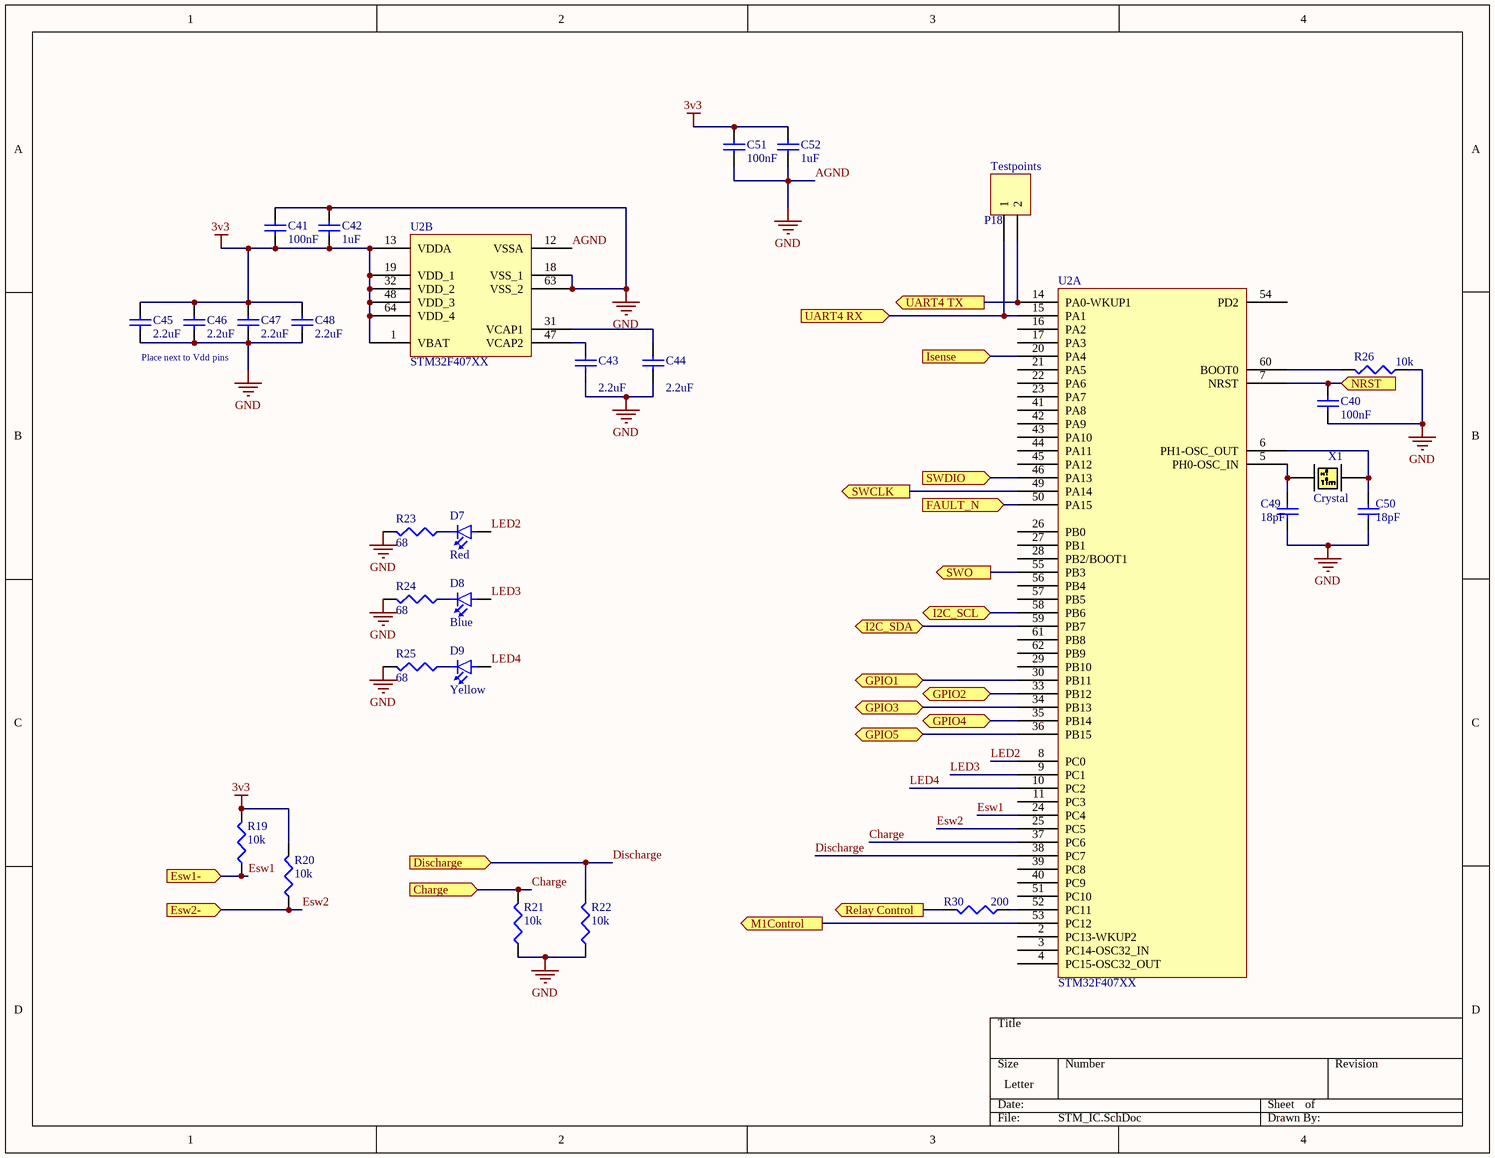
[diagram p3: STM_IC.SchDoc]

### Parts
C40  value 100nF  [SMD0603]  (hidden comment: Cap)
C41  value 100nF  [SMD0603]  (hidden comment: Cap)
C42  value 1uF  [SMD0603]  (hidden comment: Cap)
C43  value 2.2uF  [SMD0603]  (hidden comment: Cap)
C44  value 2.2uF  [SMD0603]  (hidden comment: Cap)
C45  value 2.2uF  [SMD0603]  (hidden comment: Cap)
C46  value 2.2uF  [SMD0603]  (hidden comment: Cap)
C47  value 2.2uF  [SMD0603]  (hidden comment: Cap)
C48  value 2.2uF  [SMD0603]  (hidden comment: Cap)
C49  value 18pF  [SMD0603]  (hidden comment: Cap)
C50  value 18pF  [SMD0603]  (hidden comment: Cap)
C51  value 100nF  [SMD0603]  (hidden comment: Cap)
C52  value 1uF  [SMD0603]  (hidden comment: Cap)
D7  Color: Red  [SMD0805_LED]  (hidden comment: LED)
D8  Color: Blue  [SMD0805_LED]  (hidden comment: LED)
D9  Color: Yellow  [SMD0805_LED]  (hidden comment: LED)
P18  Testpoints  [Header 2x1]
R19  value 10k  [SMD0603]  (hidden comment: Res)
R20  value 10k  [SMD0603]  (hidden comment: Res)
R21  value 10k  [SMD0603]  (hidden comment: Res)
R22  value 10k  [SMD0603]  (hidden comment: Res)
R23  value 68  [SMD0603]  (hidden comment: Res)
R24  value 68  [SMD0603]  (hidden comment: Res)
R25  value 68  [SMD0603]  (hidden comment: Res)
R26  value 10k  [SMD0603]  (hidden comment: Res)
R30  value 200  [SMD0603]  (hidden comment: Res)
U2  STM32F407XX  [LQFP64]  (parts A,B of 2)
X1  Crystal  [ABMM2-OSC]

### Ports
Charge (in), Discharge (in), Esw1- (in), Esw2- (in), FAULT_N (in), GPIO1 (bidir), GPIO2 (bidir), GPIO3 (bidir), GPIO4 (bidir), GPIO5 (bidir), I2C_SCL (bidir), I2C_SDA (bidir), Isense (in), M1Control (out), NRST (in), Relay Control (out), SWCLK (out), SWDIO (in), SWO (out), UART4 RX (in), UART4 TX (out)

### Nets
3v3: C41.1 C42.1 C45.2 C46.2 C47.2 C48.2 C51.2 C52.2 R19.2 R20.2 U2.1(VBAT) U2.13(VDDA) U2.19(VDD_1) U2.32(VDD_2) U2.48(VDD_3) U2.64(VDD_4)
AGND: C40.1 C41.2 C42.2 C43.1 C44.1 C45.1 C46.1 C47.1 C48.1 C49.1 C50.1 C51.1 C52.1 R21.1 R22.1 R23.2 R24.2 R25.2 R26.1 U2.12(VSSA) U2.18(VSS_1) U2.63(VSS_2)  [also labelled GND]
Charge: R21.2 U2.37(PC6) ; port Charge
Discharge: R22.2 U2.38(PC7) ; port Discharge
Esw1: R19.1 U2.24(PC4) ; port Esw1-
Esw2: R20.1 U2.25(PC5) ; port Esw2-
FAULT_N: U2.50(PA15) ; port FAULT_N
GPIO1: U2.30(PB11) ; port GPIO1
GPIO2: U2.33(PB12) ; port GPIO2
GPIO3: U2.34(PB13) ; port GPIO3
GPIO4: U2.35(PB14) ; port GPIO4
GPIO5: U2.36(PB15) ; port GPIO5
I2C_SCL: U2.58(PB6) ; port I2C_SCL
I2C_SDA: U2.59(PB7) ; port I2C_SDA
LED2: D7.1(Anode_(+)) U2.8(PC0)
LED3: D8.1(Anode_(+)) U2.9(PC1)
LED4: D9.1(Anode_(+)) U2.10(PC2)
NRST: C40.2 U2.7(NRST) ; port NRST
SWCLK: U2.49(PA14) ; port SWCLK
SWDIO: U2.46(PA13) ; port SWDIO
SWO: U2.55(PB3) ; port SWO
UART TX BMS: P18.1 U2.15(PA1) ; port UART4 RX
UART TX STM: P18.2 U2.14(PA0-WKUP1) ; port UART4 TX
NetC43_2: C43.2 U2.47(VCAP2)
NetC44_2: C44.2 U2.31(VCAP1)
NetC49_2: C49.2 U2.5(PH0-OSC_IN) X1.1
NetC50_2: C50.2 U2.6(PH1-OSC_OUT) X1.2
NetD7_2: D7.2(Cathode_(-)) R23.1
NetD8_2: D8.2(Cathode_(-)) R24.1
NetD9_2: D9.2(Cathode_(-)) R25.1
NetR26_2: R26.2 U2.60(BOOT0)
NetR30_1: R30.1 U2.52(PC11)
NetR30_2: R30.2 ; port Relay Control
NetU2_20: U2.20(PA4) ; port Isense
NetU2_53: U2.53(PC12) ; port M1Control

Not connected (* = marked no-connect by the designer): U2 2(PC13-WKUP2) 3(PC14-OSC32_IN) 4(PC15-OSC32_OUT) 11(PC3) 16(PA2) 17(PA3) 21(PA5) 22(PA6) 23(PA7) 26(PB0) 27(PB1) 28(PB2/BOOT1) 29(PB10) 39(PC8) 40(PC9) 41(PA8) 42(PA9) 43(PA10) 44(PA11) 45(PA12) 51(PC10) 54(PD2) 56(PB4) 57(PB5) 61(PB8) 62(PB9)

### Notes on the sheet
- Place next to Vdd pins

### Library data of the parts
C40-C52 = Capacitor Ceramic: Ceramic Chip Capacitor
P18 = Header 2x1: Header, 2-Pin
R19-R26 R30 = Resistor
U2 = STM32F407_LQFP64

## Sheet Headers.SchDoc: Headers
size Letter; Date: 1/14/2018; Author: Logan Horowitz; DocumentNumber: 6; Revision: 1.1; SheetNumber: 6; DocumentName: Headers
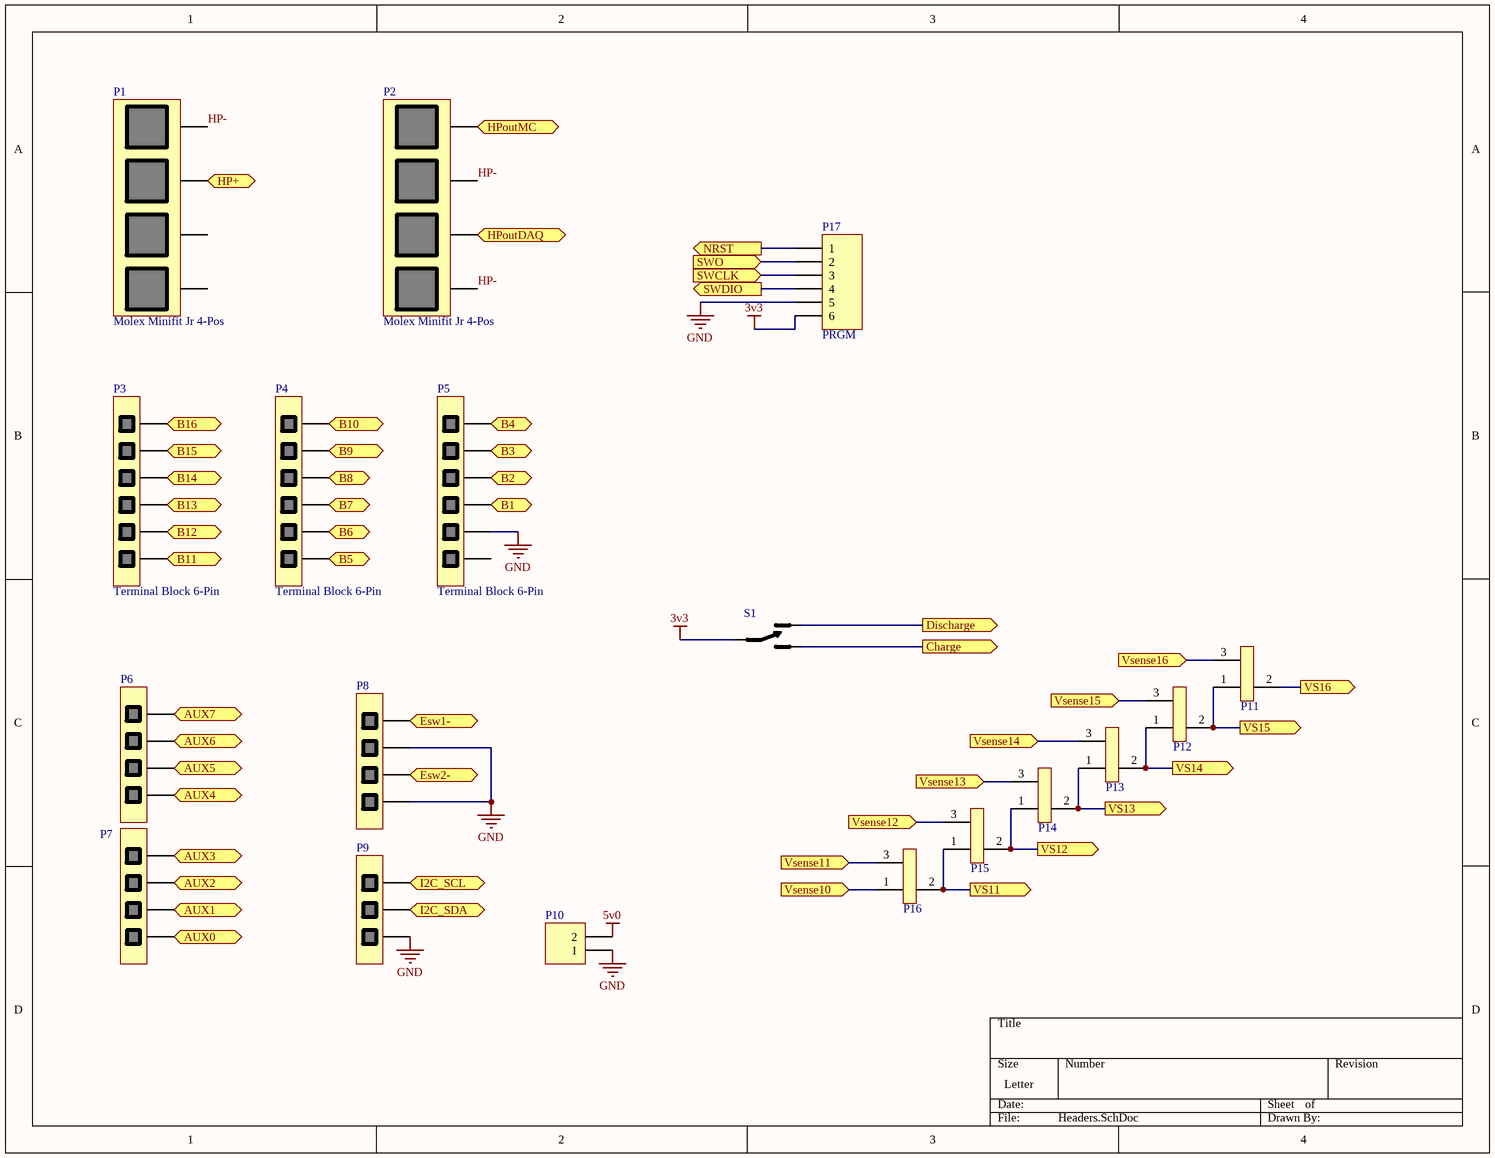
[diagram p4: Headers.SchDoc]

### Parts
P1  Molex Minifit Jr 4-Pos  [MINIFITJR 2X2]
P2  Molex Minifit Jr 4-Pos  [MINIFITJR 2X2]
P3  Terminal Block 6-Pin  [PTSM 6-Pos]
P4  Terminal Block 6-Pin  [PTSM 6-Pos]
P5  Terminal Block 6-Pin  [PTSM 6-Pos]
P6  Terminal Block 4-Pos  [PTSM 4-Pos]  (value not drawn)
P7  Terminal Block 4-Pos  [PTSM 4-Pos]  (value not drawn)
P8  Terminal Block 4-Pos  [PTSM 4-Pos]  (value not drawn)
P9  Terminal Block 3-Pos  [PTSM 3-Pos]  (value not drawn)
P10  Header  [Header 2x1]  (value not drawn)
P11  Header 3_1  [HEADER 3X1]  (value not drawn)
P12  Header 3_1  [HEADER 3X1]  (value not drawn)
P13  Header 3_1  [HEADER 3X1]  (value not drawn)
P14  Header 3_1  [HEADER 3X1]  (value not drawn)
P15  Header 3_1  [HEADER 3X1]  (value not drawn)
P16  Header 3_1  [HEADER 3X1]  (value not drawn)
P17  PRGM  [HEADER 6X1]
S1  Switch  [Switch]  (value not drawn)

### Ports
AUX0 (out), AUX1 (out), AUX2 (out), AUX3 (out), AUX4 (out), AUX5 (out), AUX6 (out), AUX7 (out), B1 (out), B2 (out), B3 (out), B4 (out), B5 (out), B6 (out), B7 (out), B8 (out), B9 (out), B10 (out), B11 (out), B12 (out), B13 (out), B14 (out), B15 (out), B16 (bidir), Charge (out), Discharge (out), Esw1- (out), Esw2- (out), HP+ (out), HPoutDAQ (in), HPoutMC (in), I2C_SCL (bidir), I2C_SDA (bidir), NRST (out), SWCLK (in), SWDIO (out), SWO (in), VS11 (out), VS12 (out), VS13 (out), VS14 (out), VS15 (out), VS16 (out), Vsense10 (in), Vsense11 (in), Vsense12 (in), Vsense13 (in), Vsense14 (in), Vsense15 (in), Vsense16 (in)

### Nets
3v3: P17.6 S1.2
5v0: P10.2
GND: P5.5 P8.2 P8.4 P9.3 P10.1 P17.5  [project net AGND]
AUX0: P7.4 ; port AUX0
AUX1: P7.3 ; port AUX1
AUX2: P7.2 ; port AUX2
AUX3: P7.1 ; port AUX3
AUX4: P6.4 ; port AUX4
AUX5: P6.3 ; port AUX5
AUX6: P6.2 ; port AUX6
AUX7: P6.1 ; port AUX7
B1: P5.4 ; port B1
B2: P5.3 ; port B2
B3: P5.2 ; port B3
B4: P5.1 ; port B4
B5: P4.6 ; port B5
B6: P4.5 ; port B6
B7: P4.4 ; port B7
B8: P4.3 ; port B8
B9: P4.2 ; port B9
B10: P4.1 ; port B10
B11: P3.6 ; port B11
B12: P3.5 ; port B12
B13: P3.4 ; port B13
B14: P3.3 ; port B14
B15: P3.2 ; port B15
B16: P3.1 ; port B16
Charge: S1.1 ; port Charge
Discharge: S1.3 ; port Discharge
Esw1: P8.1 ; port Esw1-
Esw2: P8.3 ; port Esw2-
HP+: P1.2 ; port HP+
HP-: P1.1 P2.2 P2.4
I2C_SCL: P9.1 ; port I2C_SCL
I2C_SDA: P9.2 ; port I2C_SDA
NRST: P17.1 ; port NRST
SWCLK: P17.3 ; port SWCLK
SWDIO: P17.4 ; port SWDIO
SWO: P17.2 ; port SWO
VS11: P15.1 P16.2 ; port VS11
VS12: P14.1 P15.2 ; port VS12
VS13: P13.1 P14.2 ; port VS13
VS14: P12.1 P13.2 ; port VS14
VS15: P11.1 P12.2 ; port VS15
VS16: P11.2 ; port VS16
Vsense10: P16.1 ; port Vsense10
Vsense11: P16.3 ; port Vsense11
Vsense12: P15.3 ; port Vsense12
Vsense13: P14.3 ; port Vsense13
Vsense14: P13.3 ; port Vsense14
Vsense15: P12.3 ; port Vsense15
Vsense16: P11.3 ; port Vsense16
NetP2_1: P2.1 P2.3 ; port HPoutDAQ, port HPoutMC

Not connected (* = marked no-connect by the designer): P1 3 4; P5 6

### Library data of the parts
P10 = Header 2x1: Header, 2-Pin
P17 = Header 6x1: Header, 5-Pin

## Sheet Control.SchDoc: Control
size Letter; Date: 1/14/2018; DrawnBy: Logan Horowitz; DocumentNumber: 5; Revision: 1.1; DocumentName: Control
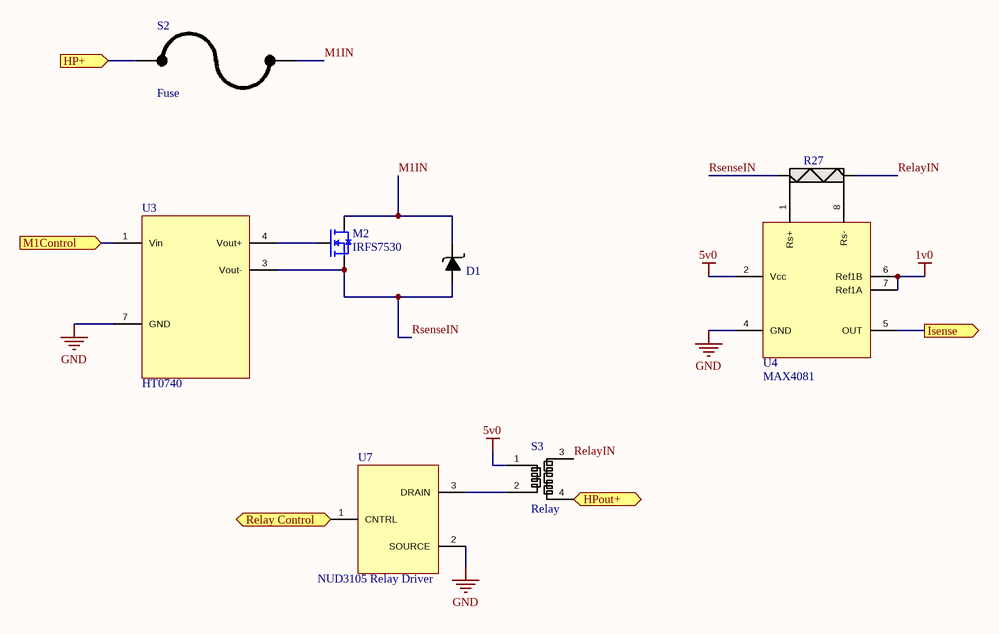
[diagram p5: Control.SchDoc]

### Parts
D1  OR Diode  [POWERDI 5]  (value not drawn)
M2  IRFS7530  [D2PAK-7]
R27  Isense Resistor  [SenseResistor]  (value not drawn)
S2  Fuse  [Fuse Holder]
S3  Relay  [JT-N Relay]
U3  HT0740  [SOIC8]
U4  MAX4081  [SOIC8]
U7  NUD3105 Relay Driver  [SOT23]

### Ports
HP+ (in), HPout+ (out), Isense (out), M1Control (in), Relay Control (in)

### Nets
1v0: U4.6(Ref1B) U4.7(Ref1A)
5v0: S3.1(coil1) U4.2(Vcc)
GND: U3.7(GND) U4.4(GND) U7.2(SOURCE)  [project net AGND]
HP+: S2.1 ; port HP+
M1IN: D1.2 M2.D S2.2
Relay Control: U7.1(CNTRL) ; port Relay Control
RelayIN: R27.2(OUT) S3.3(OUT1)
RsenseIN: D1.1 M2.S R27.1(IN) U3.3(Vout-)
NetM2_G: M2.G U3.4(Vout+)
NetP2_1: S3.4(OUT2) ; port HPout+
NetR27_3: R27.3(senseHI) U4.1(Rs+)
NetR27_4: R27.4(senseLOW) U4.8(Rs-)
NetS3_2: S3.2(coil2) U7.3(DRAIN)
NetU2_20: U4.5(OUT) ; port Isense
NetU2_53: U3.1(Vin) ; port M1Control

### Library data of the parts
M2 = IRFS7530: IRFS7530 Power MOSFET

## Sheet Power.SchDoc
size Letter
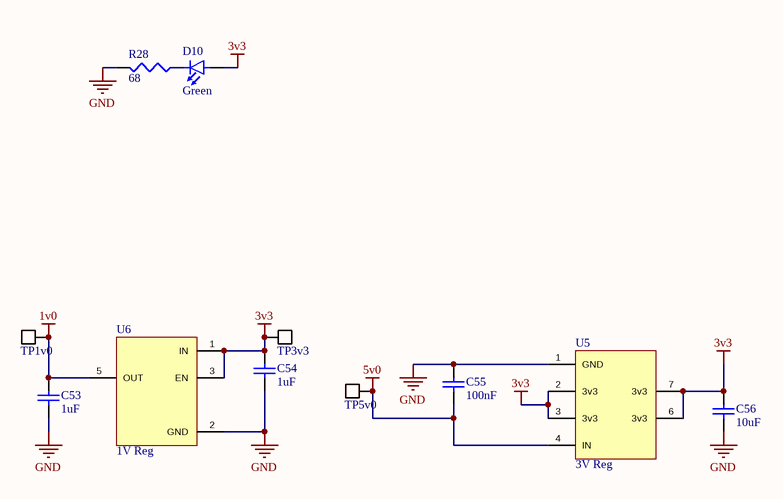
[diagram p6: Power.SchDoc]

### Parts
C53  value 1uF  [SMD0603]  (hidden comment: Cap)
C54  value 1uF  [SMD0603]  (hidden comment: Cap)
C55  value 100nF  [SMD0603]  (hidden comment: Cap)
C56  value 10uF  [SMD0603]  (hidden comment: Cap)
D10  Color: Green  [SMD0805_LED]  (hidden comment: LED)
R28  value 68  [SMD0603]  (hidden comment: Res)
TP1v0  Test Point  [Test Point]  (value not drawn)
TP3v3  Test Point  [Test Point]  (value not drawn)
TP5v0  Test Point  [Test Point]  (value not drawn)
U5  3V Reg  [SOIC8]
U6  1V Reg  [SOT23-5Lead]

### Nets
1v0: C53.2 TP1v0.1 U6.5(OUT)
3v3: C54.2 C56.2 D10.1(Anode_(+)) TP3v3.1 U5.2(3v3) U5.3(3v3) U5.6(3v3) U5.7(3v3) U6.1(IN) U6.3(EN)
5v0: C55.1 TP5v0.1 U5.4(IN)
GND: C53.1 C54.1 C55.2 C56.1 R28.2 U5.1(GND) U6.2(GND)  [project net AGND]
NetD10_2: D10.2(Cathode_(-)) R28.1

### Library data of the parts
C53-C56 = Capacitor Ceramic: Ceramic Chip Capacitor
R28 = Resistor
TP1v0 TP3v3 TP5v0 = Test Point: Supplier 1: Digi-Key; Supplier Part Number 1: 5019KCT-ND

## Nets that join several sheets
1v0: Control (U4.6 U4.7), Power (C53.2 TP1v0.1 U6.5)
3v3: BMS_IC (R5.1), STM_IC (16 pins), Headers (P17.6 S1.2), Power (10 pins)
5v0: Headers (P10.2), Control (S3.1 U4.2), Power (C55.1 TP5v0.1 U5.4)
AGND: BMS_IC (36 pins), Cell_Connections (19 pins), STM_IC (22 pins), Headers (6 pins), Control (U3.7 U4.4 U7.2), Power (7 pins)
AUX0: BMS_IC (R15.1), Headers (P7.4)
AUX1: BMS_IC (R14.1), Headers (P7.3)
AUX2: BMS_IC (R13.1), Headers (P7.2)
AUX3: BMS_IC (R12.1), Headers (P7.1)
AUX4: BMS_IC (R11.1), Headers (P6.4)
AUX5: BMS_IC (R10.1), Headers (P6.3)
AUX6: BMS_IC (R9.1), Headers (P6.2)
AUX7: BMS_IC (R8.1), Headers (P6.1)
B1: Cell_Connections (Q2.3 R38.2 R39.2 R40.2), Headers (P5.4)
B2: Cell_Connections (Q3.3 R42.2 R43.2 R44.2), Headers (P5.3)
B3: Cell_Connections (Q4.3 R46.2 R47.2 R48.2), Headers (P5.2)
B4: Cell_Connections (Q5.3 R50.2 R51.2 R52.2), Headers (P5.1)
B5: Cell_Connections (Q6.3 R54.2 R55.2 R56.2), Headers (P4.6)
B6: Cell_Connections (Q7.3 R58.2 R59.2 R60.2), Headers (P4.5)
B7: Cell_Connections (Q8.3 R62.2 R63.2 R64.2), Headers (P4.4)
B8: Cell_Connections (5 pins), Headers (P4.3)
B9: Cell_Connections (Q10.3 R70.2 R71.2 R72.2), Headers (P4.2)
B10: Cell_Connections (5 pins), Headers (P4.1)
B11: Cell_Connections (6 pins), Headers (P3.6)
B12: Cell_Connections (6 pins), Headers (P3.5)
B13: Cell_Connections (6 pins), Headers (P3.4)
B14: Cell_Connections (6 pins), Headers (P3.3)
B15: Cell_Connections (6 pins), Headers (P3.2)
B16: BMS_IC (D6.2 R1.2 R16.1), Cell_Connections (P19.2 R98.2 R99.2), Headers (P3.1)
Charge: STM_IC (R21.2 U2.37), Headers (S1.1)
Discharge: STM_IC (R22.2 U2.38), Headers (S1.3)
EQ1: BMS_IC (U1.28), Cell_Connections (R37.1)
EQ2: BMS_IC (U1.26), Cell_Connections (R41.1)
EQ3: BMS_IC (U1.24), Cell_Connections (R45.1)
EQ4: BMS_IC (U1.22), Cell_Connections (R49.1)
EQ5: BMS_IC (U1.20), Cell_Connections (R53.1)
EQ6: BMS_IC (U1.18), Cell_Connections (R57.1)
EQ7: BMS_IC (U1.16), Cell_Connections (R61.1)
EQ8: BMS_IC (U1.14), Cell_Connections (R65.1)
EQ9: BMS_IC (U1.12), Cell_Connections (R69.1)
EQ10: BMS_IC (U1.10), Cell_Connections (R73.1)
EQ11: BMS_IC (U1.8), Cell_Connections (R77.1)
EQ12: BMS_IC (U1.6), Cell_Connections (R81.1)
EQ13: BMS_IC (U1.4), Cell_Connections (R85.1)
EQ14: BMS_IC (U1.2), Cell_Connections (R89.1)
EQ15: BMS_IC (U1.80), Cell_Connections (R93.1)
EQ16: BMS_IC (U1.78), Cell_Connections (R97.1)
Esw1: STM_IC (R19.1 U2.24), Headers (P8.1)
Esw2: STM_IC (R20.1 U2.25), Headers (P8.3)
FAULT_N: BMS_IC (R5.2 U1.40), STM_IC (U2.50)
GPIO1: BMS_IC (U1.46), STM_IC (U2.30)
GPIO2: BMS_IC (U1.45), STM_IC (U2.33)
GPIO3: BMS_IC (U1.44), STM_IC (U2.34)
GPIO4: BMS_IC (U1.43), STM_IC (U2.35)
GPIO5: BMS_IC (U1.42), STM_IC (U2.36)
HP+: Headers (P1.2), Control (S2.1)
I2C_SCL: STM_IC (U2.58), Headers (P9.1)
I2C_SDA: STM_IC (U2.59), Headers (P9.2)
NetC1_1: BMS_IC (U1.27), Cell_Connections (C1.1 R39.1 Z1.2 Z2.1)
NetC2_1: BMS_IC (U1.25), Cell_Connections (C2.1 R43.1 Z2.2 Z3.1)
NetC3_1: BMS_IC (U1.23), Cell_Connections (C3.1 R47.1 Z3.2 Z4.1)
NetC4_1: BMS_IC (U1.21), Cell_Connections (C4.1 R51.1 Z4.2 Z5.1)
NetC5_1: BMS_IC (U1.19), Cell_Connections (C5.1 R55.1 Z5.2 Z6.1)
NetC6_1: BMS_IC (U1.17), Cell_Connections (C6.1 R59.1 Z6.2 Z7.1)
NetC7_1: BMS_IC (U1.15), Cell_Connections (C7.1 R63.1 Z7.2 Z8.1)
NetC8_1: BMS_IC (U1.13), Cell_Connections (C8.1 R67.1 Z8.2)
NetC9_1: BMS_IC (U1.11), Cell_Connections (C9.1 R71.1 Z9.2 Z10.1)
NetC18_2: BMS_IC (C18.2 D2.2 D3.3 U1.29), Cell_Connections (R35.1 Z1.1)
NetP2_1: Headers (P2.1 P2.3), Control (S3.4)
NetU2_20: STM_IC (U2.20), Control (U4.5)
NetU2_53: STM_IC (U2.53), Control (U3.1)
NRST: STM_IC (C40.2 U2.7), Headers (P17.1)
SWCLK: STM_IC (U2.49), Headers (P17.3)
SWDIO: STM_IC (U2.46), Headers (P17.4)
SWO: STM_IC (U2.55), Headers (P17.2)
UART TX BMS: BMS_IC (R6.2 U1.38), STM_IC (P18.1 U2.15)
UART TX STM: BMS_IC (R7.2 U1.39), STM_IC (P18.2 U2.14)
VS11: BMS_IC (U1.7), Headers (P15.1 P16.2)
VS12: BMS_IC (U1.5), Headers (P14.1 P15.2)
VS13: BMS_IC (U1.3), Headers (P13.1 P14.2)
VS14: BMS_IC (U1.1), Headers (P12.1 P13.2)
VS15: BMS_IC (U1.79), Headers (P11.1 P12.2)
VS16: BMS_IC (D4.2 D5.3 U1.77), Headers (P11.2)
Vsense10: BMS_IC (U1.9), Cell_Connections (C10.1 R75.1 Z10.2 Z11.1), Headers (P16.1)
Vsense11: Cell_Connections (C11.1 R79.1 Z11.2 Z12.1), Headers (P16.3)
Vsense12: Cell_Connections (C12.1 R83.1 Z12.2 Z13.1), Headers (P15.3)
Vsense13: Cell_Connections (C13.1 R87.1 Z13.2 Z14.1), Headers (P14.3)
Vsense14: Cell_Connections (C14.1 R91.1 Z14.2 Z15.1), Headers (P13.3)
Vsense15: Cell_Connections (C15.1 R95.1 Z15.2 Z16.1), Headers (P12.3)
Vsense16: Cell_Connections (C16.1 R99.1 Z16.2), Headers (P11.3)